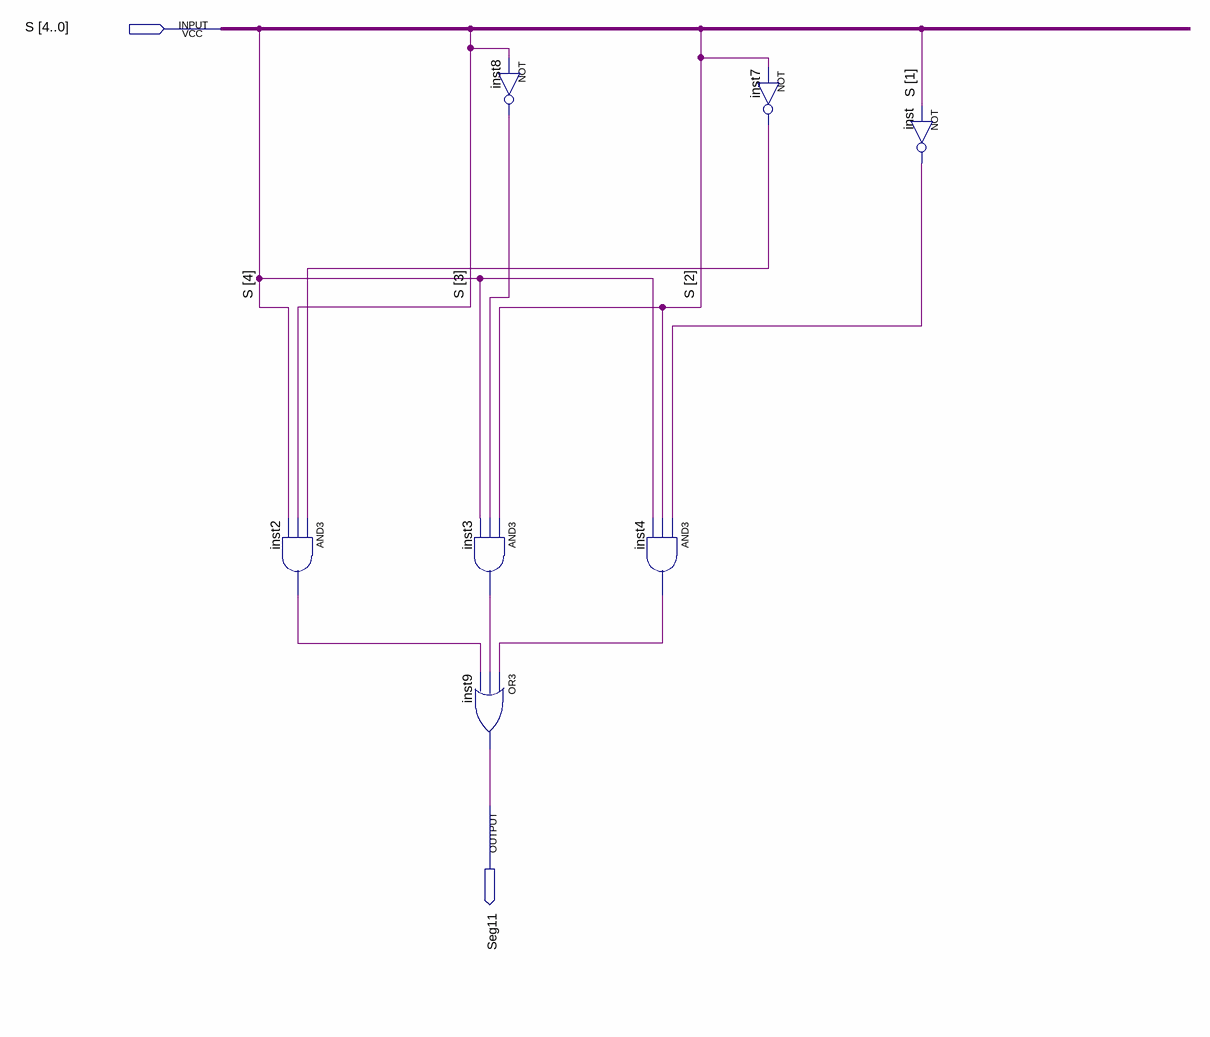
[diagram p0: schematic sheet]
// Quartus schematic Seg11.bdf as structural Verilog: 7 symbols, 2 pins
module Seg11 (
  input  [4:0] S,
  output Seg11
);

  wire inst2_out, inst3_out, inst4_out, inst7_out, inst8_out, inst_out;

  and inst2 (inst2_out, inst7_out, S[3], S[4]);
  not inst8 (inst8_out, S[3]);
  and inst3 (inst3_out, S[2], inst8_out, S[4]);
  or inst9 (Seg11, inst4_out, inst3_out, inst2_out);
  and inst4 (inst4_out, inst_out, S[2], S[4]);
  not inst7 (inst7_out, S[2]);
  not inst (inst_out, S[1]);
endmodule
